# Altium project MiniPC.PrjPcb (part 14 of 17)

## Sheet 3.3V_to_1.0V.SchDoc: 3.3V to 1.0V Converter
size B; DocumentNumber: 41; SheetNumber: 41; SheetTotal: 46
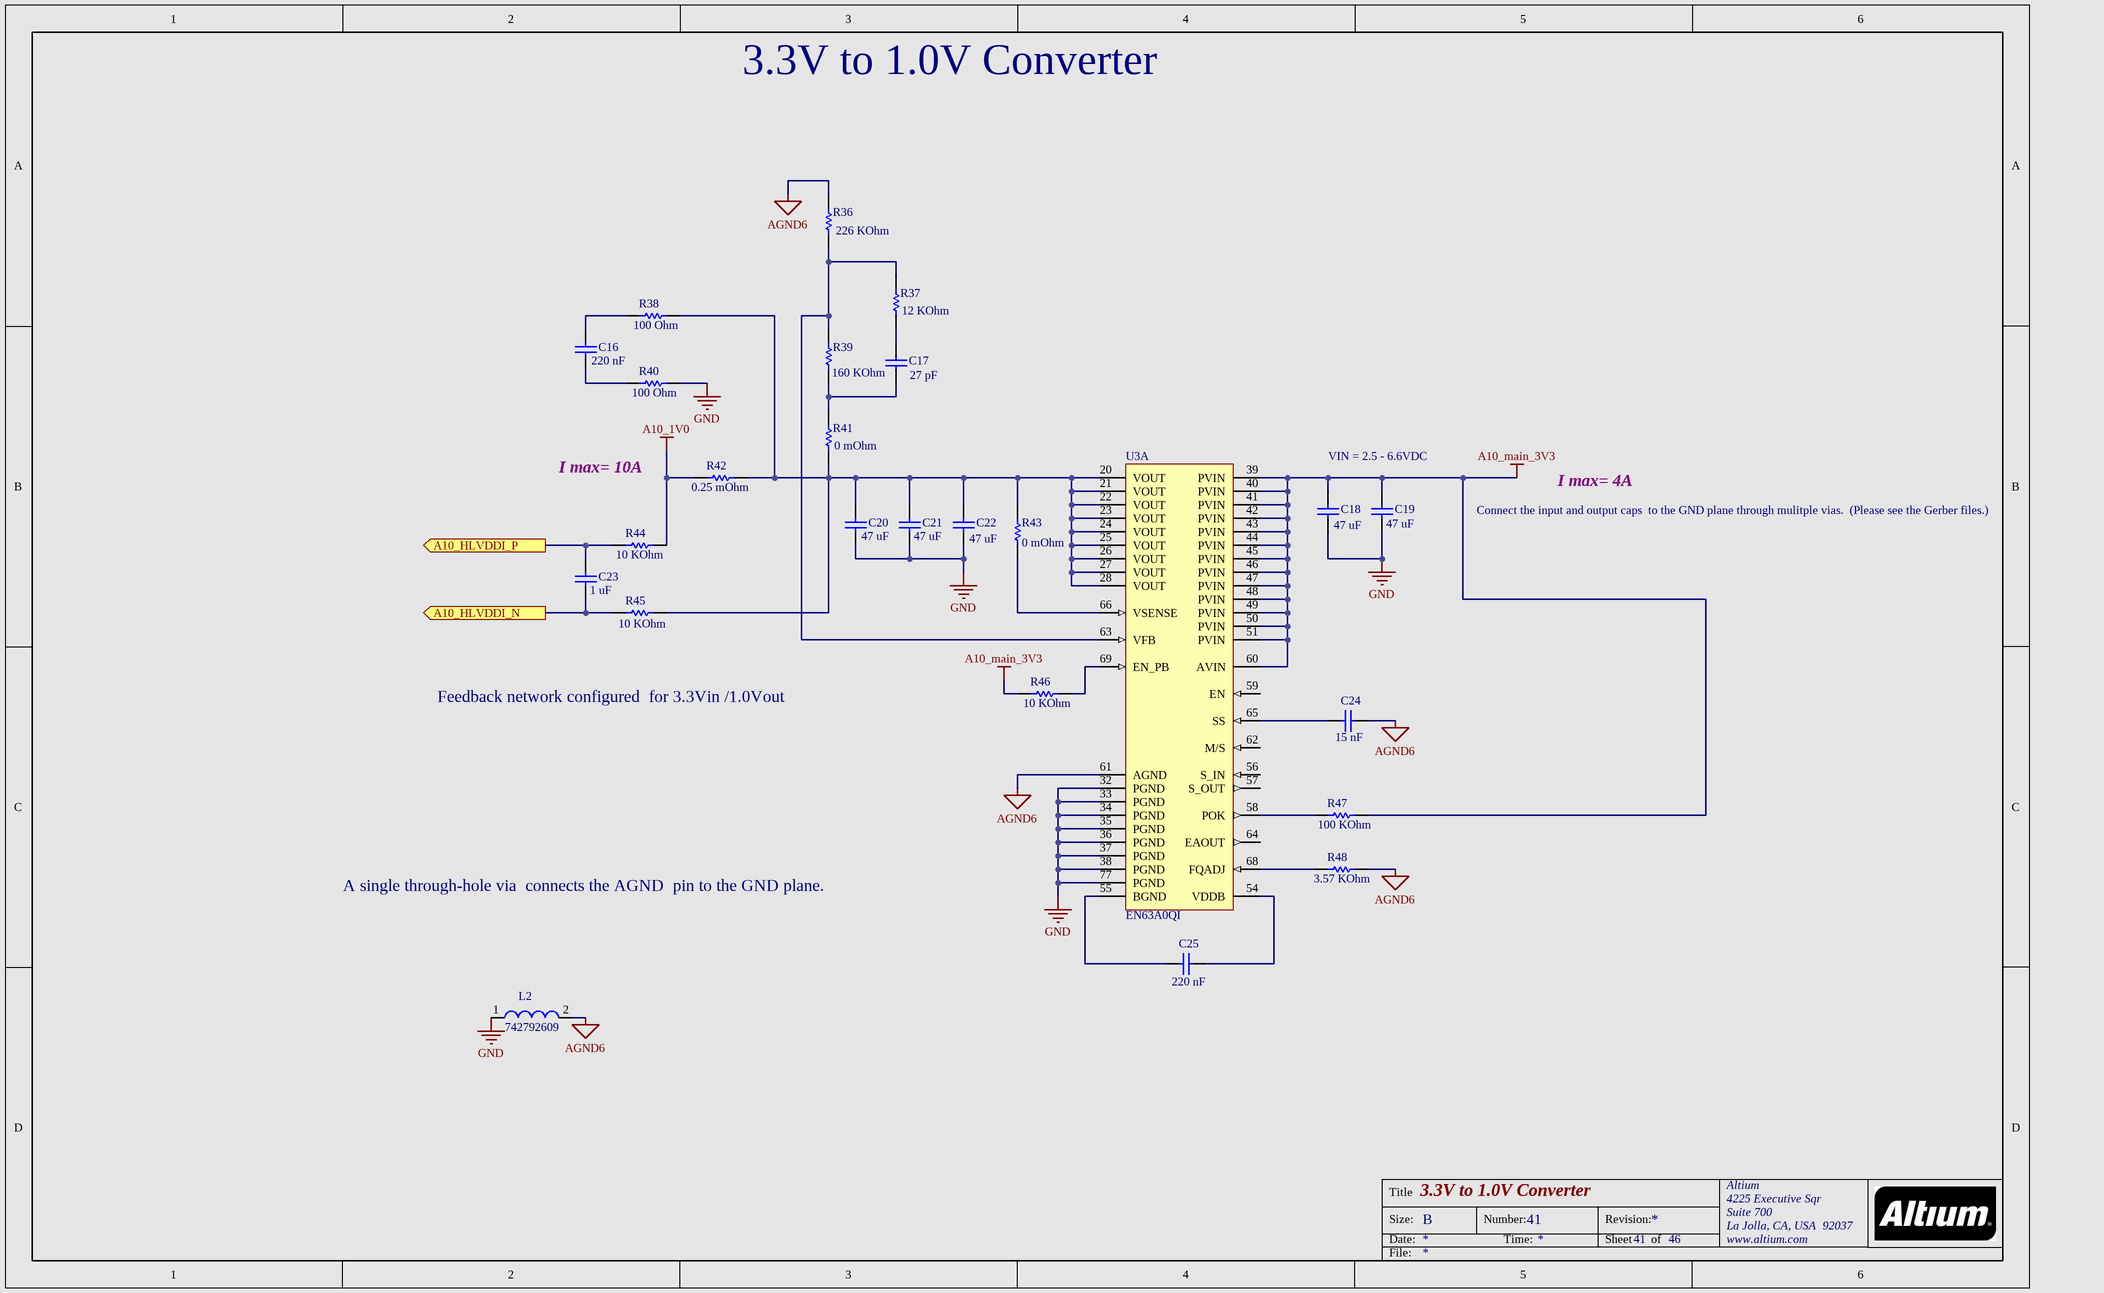
[diagram p43: 3.3V_to_1.0V.SchDoc]

### Parts
C16  Capacitance: 220 nF  [CAPC1005X55X25NL05T10]  (hidden comment: GRM155R61A224KE19D)
C17  Capacitance: 27 pF  [CAPC1005X55X20ML5T10]  (hidden comment: ECJ-0EC1H270J)
C18  Capacitance: 47 uF  [CAPC3216X180X20ML20]  (hidden comment: C3216X5R1A476M160AB)
C19  Capacitance: 47 uF  [CAPC3216X180X20ML20]  (hidden comment: C3216X5R1A476M160AB)
C20  Capacitance: 47 uF  [CAPC3216X180X20ML20]  (hidden comment: C3216X5R1A476M160AB)
C21  Capacitance: 47 uF  [CAPC3216X180X20ML20]  (hidden comment: C3216X5R1A476M160AB)
C22  Capacitance: 47 uF  [CAPC3216X180X20ML20]  (hidden comment: C3216X5R1A476M160AB)
C23  Capacitance: 1 uF  [CAPC1005X33X10LL5]  (hidden comment: CGB2A1X5R1E105K033BC)
C24  Capacitance: 15 nF  [CAPC1005X55X23ML05T8]  (hidden comment: VJ0402Y153JXQPW1BC)
C25  Capacitance: 220 nF  [CAPC1005X55X25NL05T10]  (hidden comment: GRM155R61A224KE19D)
L2  742792609  [SMD-0603]
R36  Resistance: 226 KOhm  [RESC1005X40X25NL05T05]  (hidden comment: ERJ-2RKF2263X)
R37  Resistance: 12 KOhm  [RESC1005X40X25ML05T05]  (hidden comment: ERJ-2RKF1202X)
R38  Resistance: 100 Ohm  [RESC1005X40X25LL05T05]  (hidden comment: ERJ-2RKF1000X)
R39  Resistance: 160 KOhm  [RESC1005X40X25ML05T05]  (hidden comment: CRCW0402160KFKED)
R40  Resistance: 100 Ohm  [RESC1005X40X25LL05T05]  (hidden comment: ERJ-2RKF1000X)
R41  Resistance: 0 mOhm  [RESC1005X40X25ML05T05]  (hidden comment: ERJ-2GE0R00X)
R42  Resistance: 0.25 mOhm  [STAC-CSS2725-099H_V]  (hidden comment: CSS2725FTL250)
R43  Resistance: 0 mOhm  [RESC1005X40X25ML05T05]  (hidden comment: ERJ-2GE0R00X)
R44  Resistance: 10 KOhm  [RESC1005X40X25NL05T05]  (hidden comment: ERJ-2RKF1002X)
R45  Resistance: 10 KOhm  [RESC1005X40X25NL05T05]  (hidden comment: ERJ-2RKF1002X)
R46  Resistance: 10 KOhm  [RESC1005X40X25NL05T05]  (hidden comment: ERJ-2RKF1002X)
R47  Resistance: 100 KOhm  [RESC1005X40X25LL05T05]  (hidden comment: ERJ-2RKF1003X)
R48  Resistance: 3.57 KOhm  [RESC1005X40X25NL05T05]  (hidden comment: CRCW04023K57FKED)
U3  EN63A0QI  [ALTR-QFN-76_A-305_V]  (part A of 2)

### Ports
A10_HLVDDI_N (out), A10_HLVDDI_P (out)

### Nets
A10_1V0: R42.1 R44.2
A10_main_3V3: C18.2 C19.2 R46.1 R47.2 U3.39(PVIN) U3.40(PVIN) U3.41(PVIN) U3.42(PVIN) U3.43(PVIN) U3.44(PVIN) U3.45(PVIN) U3.46(PVIN) U3.47(PVIN) U3.48(PVIN) U3.49(PVIN) U3.50(PVIN) U3.51(PVIN) U3.60(AVIN)
AGND6: C24.1 L2.2 R36.2 R48.2 U3.61(AGND)
GND: C18.1 C19.1 C20.1 C21.1 C22.1 L2.1 R40.1 U3.32(PGND) U3.33(PGND) U3.34(PGND) U3.35(PGND) U3.36(PGND) U3.37(PGND) U3.38(PGND) U3.77(PGND)
A10_HLVDDI_N: C23.1 R45.1 ; port A10_HLVDDI_N
A10_HLVDDI_P: C23.2 R44.1 ; port A10_HLVDDI_P
NetC16_1: C16.1 R38.2
NetC16_2: C16.2 R40.2
NetC17_1: C17.1 R39.1 R41.2
NetC17_2: C17.2 R37.1
NetC20_2: C20.2 C21.2 C22.2 R38.1 R41.1 R42.2 R43.2 R45.2 U3.20(VOUT) U3.21(VOUT) U3.22(VOUT) U3.23(VOUT) U3.24(VOUT) U3.25(VOUT) U3.26(VOUT) U3.27(VOUT) U3.28(VOUT)
NetC24_2: C24.2 U3.65(SS)
NetC25_1: C25.1 U3.55(BGND)
NetC25_2: C25.2 U3.54(VDDB)
NetR36_1: R36.1 R37.2 R39.2 U3.63(VFB)
NetR43_1: R43.1 U3.66(VSENSE)
NetR46_2: R46.2 U3.69(EN_PB)
NetR47_1: R47.1 U3.58(POK)
NetR48_1: R48.1 U3.68(FQADJ)

Not connected (* = marked no-connect by the designer): U3 56(S_IN) 57(S_OUT) 59(EN) 62(M/S) 64(EAOUT)

### Notes on the sheet
- I max= 10A
- VIN = 2.5 - 6.6VDC
- I max= 4A
- Connect the input and output caps  to the GND plane through mulitple vias.  (Please see the Gerber files.)
- Feedback network configured  for 3.3Vin /1.0Vout
- A single through-hole via  connects the AGND  pin to the GND plane.
- Title
- Size:
- Date:
- B
- Number:
- Time:
- Revision:
- Sheet
- of
- File:

### Library data of the parts
C16 C25 = CMP-2008-04561-4: as C115 on sheet 12V_to_5V; ComponentLink1URL: http://www.murata.com/; Package Quantity: 1; Tolerance: 10%; Mounting Technology: Surface Mount; RoHSCompliant: true; PartNumber: GRM155R61A224KE19D; Max Operating Temperature: 85 degC; Case Code (Imperial): 0402; Length: 1 mm; Packaging: Tape and Reel; Min Operating Temperature: -55 degC; PackageDescription: 2-Pin Surface Mount Device, Body 1 x 0.5 mm; Height: 0.5 mm; Case Code (Metric): 1005; REACH SVHC: No SVHC; ComponentLink1Description: Manufacturer URL; Width: 0.5 mm; ComponentLink2URL: http://search.murata.co.jp/Ceramy/image/img/A01X/G101/ENG/GRM155R61A224KE19-01.pdf; Radiation Hardening: No; Pins: 2; Voltage Rating (DC): 10 V; DatasheetVersion: 03/2016; Mount: Surface Mount; PackageReference: 0402; ComponentLink2Description: Datasheet
C17 = CMP-1665-00021-1: Chip Capacitor, 27 pF, +/- 5%, 50 V, -55 to 125 degC, 0402 (1005 Metric), RoHS, Tape and Reel; Voltage Rating: 50 V; Case\/Package: 0402; Type (Capacitors): C0G; Tolerance: 5%; Min Operating Temperature: -55 degC; Max Operating Temperature: 125 degC; DatasheetVersion: 09/2008; Width: 0.02 inch; Packaging: Tape and Reel; RoHSCompliant: true; ComponentLink2URL: http://media.digikey.com/pdf/Data%20Sheets/Panasonic%20Capacitors%20PDFs/ECJ_(General).pdf; Mount: Surface Mount; ComponentLink1URL: http://www.panasonic.com/; PackageDescription: 2-Pin Surface Mount Device, Body 1 x 0.5 mm; Length: 0.039 inch; Case Code (Metric): 1005; Package Quantity: 10000; ComponentLink2Description: Datasheet; PackageReference: 0402; Height: 0.5 mm; Case Code (Imperial): 0402; Mounting Technology: Surface Mount; ComponentLink1Description: Manufacturer URL
C18-C22 = CMP-1663-00005-1: as C112 on sheet 12V_to_5V; Tolerance: 20%; Voltage Rating: 10 V; Packaging: Tape and Reel; ComponentLink2URL: https://product.tdk.com/info/en/catalog/datasheets/mlcc_commercial_general_en.pdf; Min Operating Temperature: -55 degC; Length: 3.2 mm; Radiation Hardening: No; Mounting Technology: Surface Mount; PackageDescription: 2-Pin Surface Mount Device, Body 3.2 x 1.6 mm; Max Operating Temperature: 85 degC; Case Code (Metric): 3216; ComponentLink1URL: http://www.tdk.com/; DatasheetVersion: 03/2015; Mount: Surface Mount; Case Code (Imperial): 1206; Package Quantity: 2000; ComponentLink2Description: Datasheet; PackageReference: 3216; Height: 1.6 mm; RoHSCompliant: true; Width: 1.6 mm; ComponentLink1Description: Manufacturer URL
C23 = CMP-1663-00006-2: as C109 on sheet 12V_to_5V; Tolerance: 10%; PackageDescription: 2-Pin Surface Mount Device, Body 1 x 0.5 mm; PartNumber: CGB2A1X5R1E105K033BC; Case Code (Metric): 1005; DatasheetVersion: 04/2015; RoHSCompliant: True; Max Operating Temperature: 85 degC; ComponentLink2URL: https://product.tdk.com/info/en/catalog/datasheets/mlcc_commercial_lowprofile_en.pdf; Package Quantity: 1; Width: 0.02 inch; Case/Package: 0402; Case Code (Imperial): 0402; Packaging: Tape and Reel; Length: 0.039 inch; Min Operating Temperature: -55 degC; Mounting Technology: Surface Mount; ComponentLink2Description: Datasheet; ComponentLink1URL: http://www.tdk.com/; ComponentLink1Description: Manufacturer URL
C24 = CMP-1666-00015-3: as C14 on sheet 3.3V_to_0.9V; DatasheetVersion: 07/2016; ComponentLink1Description: Manufacturer URL; ComponentLink1URL: http://www.vishay.com/; PackageDescription: 2-Pin Surface Mount Device, Body 1 x 0.5 mm; ComponentLink2URL: http://www.vishay.com/docs/28548/vjw1bcbascomseries.pdf; ComponentLink2Description: Datasheet; Mounting Technology: Surface Mount; Length: 1 mm; PartNumber: VJ0402Y153JXQPW1BC; RoHSCompliant: true; Package Quantity: 50000; Min Operating Temperature: -55 degC; Case Code (Metric): 1005; Max Operating Temperature: 125 degC; Width: 0.5 mm; Tolerance: 5%; Packaging: Tape and Reel; Case Code (Imperial): 0402; Height: 0.5 mm; PackageReference: 0402; Mount: Surface Mount; Pins: 2; Voltage Rating: 10 V
L2 = CMP-0220-00193-1: as L10 on sheet 12V_to_5V; ComponentLink2URL: http://www.we-online.de/katalog/media/pdf/742792609.pdf; ComponentLink1URL: http://www.we-online.com; ComponentLink2Description: Datasheet; PackageDescription: Chip Inductor, 2-Leads, Body 1.6 x 0.8 mm; ComponentLink1Description: Manufacturer Link; PackageReference: SMD-0603; DatasheetVersion: Dec-2005; PackageVersion: 2009
R36 = CMP-2002-00784-3: Chip Resistor, 226 KOhm, +/- 1%, 100 mW, -55 to 155 degC, 0402 (1005 Metric), RoHS, Tape and Reel; Manufacturer: Basic Passives; Voltage Rating: 50 V; Power Rating: 100 mW; Case\/Package: 0402; PackageDescription: 2-Pin Surface Mount Device, Body 1 x 0.5 mm; Case Code (Metric): 1005; Tolerance: 1%; Max Operating Temperature: 155 degC; Package Quantity: 10000; Min Operating Temperature: -55 degC; Length: 1 mm; ComponentLink1Description: Manufacturer URL; Packaging: Tape and Reel; Mounting Technology: Surface Mount; PartNumber: ERJ-2RKF2263X; REACH SVHC: Unknown; RoHSCompliant: true; Mount: Surface Mount; ComponentLink1URL: http://www.panasonic.com/; Case Code (Imperial): 0402; Height: 0.35 mm; Width: 0.5 mm; ComponentLink2URL: http://industrial.panasonic.com/cdbs/www-data/pdf/RDA0000/AOA0000C86.pdf; ComponentLink2Description: Datasheet; PackageReference: 0402; Radiation Hardening: No; DatasheetVersion: 04/2015; Pins: 2; Weight: 2.8E-05oz
R37 = CMP-1665-00028-3: Chip Resistor, 12 KOhm, +/- 1%, 0.1 W, -55 to 155 degC, 0402 (1005 Metric), RoHS, Tape and Reel; Voltage Rating: 50 V; Case\/Package: 0402; Power Rating: 100 mW; Max Operating Temperature: 155 degC; Case Code (Imperial): 0402; Case Code (Metric): 1005; PartNumber: ERJ-2RKF1202X; Package Quantity: 10000; REACH SVHC: Yes; Width: 0.5 mm; Mounting Technology: Surface Mount; Packaging: Tape and Reel; Tolerance: 1%; ComponentLink1Description: Manufacturer URL; ComponentLink1URL: http://www.panasonic.com/; Height: 0.35 mm; Length: 1 mm; PackageDescription: 2-Pin Surface Mount Device, Body 1 x 0.5 mm; Min Operating Temperature: -55 degC; RoHSCompliant: true; ComponentLink2URL: http://industrial.panasonic.com/cdbs/www-data/pdf/RDA0000/AOA0000C86.pdf; DatasheetVersion: 04/2015; ComponentLink2Description: Datasheet; PackageReference: 0402; Pins: 2; Mount: Surface Mount
R38 R40 = CMP-2002-00605-3: as R28 on sheet 3.3V_to_0.9V; ComponentLink1URL: http://www.panasonic.com/; Package Quantity: 10000; Packaging: Tape and Reel; PackageDescription: 2-Pin Surface Mount Device, Body 1 x 0.5 mm; Tolerance: 1%; ComponentLink1Description: Manufacturer URL; REACH SVHC: Yes; Case Code (Imperial): 0402; Mounting Technology: Surface Mount; Min Operating Temperature: -55 degC; RoHSCompliant: true; Length: 1 mm; Width: 0.5 mm; Height: 0.35 mm; Max Operating Temperature: 155 degC; PartNumber: ERJ-2RKF1000X; Mount: Surface Mount; Case Code (Metric): 1005; Pins: 2; ComponentLink2Description: Datasheet; PackageReference: 0402; DatasheetVersion: 04/2015; Radiation Hardening: No; ComponentLink2URL: http://industrial.panasonic.com/cdbs/www-data/pdf/RDA0000/AOA0000C86.pdf
R39 = CMP-2002-08227-3: as R24 on sheet 3.3V_to_0.9V; Tolerance: 1%; Min Operating Temperature: -55 degC; Length: 1 mm; Height: 0.35 mm; Package Quantity: 10; Mounting Technology: Surface Mount; Mount: Surface Mount; Max Operating Temperature: 155 degC; PartNumber: CRCW0402160KFKED; Case Code (Imperial): 0402; Packaging: Tape and Reel; ComponentLink1Description: Manufacturer URL; Case Code (Metric): 1005; ComponentLink1URL: http://www.vishay.com/; RoHSCompliant: true; REACH SVHC: Unknown; PackageDescription: 2-Pin Surface Mount Device, Body 1 x 0.5 mm; Width: 0.5 mm; ComponentLink2Description: Datasheet; Pins: 2; PackageReference: 0402; Weight: 2.3E-05oz; ComponentLink2URL: http://www.vishay.com/docs/20035/dcrcwe3.pdf; Radiation Hardening: No; DatasheetVersion: 06/2012
R41 R43 = CMP-2002-00429-3: as R173 on sheet 12V_to_5V; Max Operating Temperature: 155 degC; Tolerance: 5%; PartNumber: ERJ-2GE0R00X; Case Code (Imperial): 0402; Package Quantity: 10000; Length: 1 mm; Mounting Technology: Surface Mount; ComponentLink1URL: http://www.panasonic.com/; Height: 0.35 mm; Width: 0.5 mm; Min Operating Temperature: -55 degC; Case Code (Metric): 1005; RoHSCompliant: true; REACH SVHC: Unknown; ComponentLink1Description: Manufacturer URL; Packaging: Tape and Reel; Mount: Surface Mount; PackageDescription: 2-Pin Surface Mount Device, Body 1 x 0.5 mm; PackageReference: 0402; ComponentLink2URL: http://industrial.panasonic.com/cdbs/www-data/pdf/RDA0000/AOA0000C84.pdf; DatasheetVersion: 03/2015; Radiation Hardening: No; Pins: 2; ComponentLink2Description: Datasheet
R42 = CMP-1719-00001-2: Chip Resistor, 0.25 mOhm, +/- 1%, 4 W, -55 to 225 degC, 2725 (6865 Metric), RoHS, Tape and Reel; RoHSCompliant: True; ComponentLink2URL: https://www.seielect.com/catalog/SEI-CSS_CSSH.PDF; DatasheetVersion: 06/2016; Radiation Hardening: No; Packaging: Tape and Reel; Package Quantity: 1000; Max Operating Temperature: 225 degC; PackageDescription: 2-Pin Surface Mount Device, Body 6.81 x 6.45 mm; PartNumber: CSS2725FTL250; Length: 0.268 inch; Height: 0.049 inch; ComponentLink1Description: Manufacturer URL; Mounting Technology: Surface Mount; Width: 0.254 inch; ComponentLink2Description: Datasheet; ComponentLink1URL: https://www.seielect.com/; Min Operating Temperature: -55 degC; Tolerance: 1%
R44-R46 = CMP-2002-00607-3: as R175 on sheet 12V_to_5V; Case Code (Imperial): 0402; Min Operating Temperature: -55 degC; PartNumber: ERJ-2RKF1002X; Mounting Technology: Surface Mount; Length: 1 mm; Packaging: Tape and Reel; ComponentLink1Description: Manufacturer URL; Mount: Surface Mount; Package Quantity: 10000; Max Operating Temperature: 155 degC; Case Code (Metric): 1005; Height: 0.35 mm; ComponentLink1URL: http://www.panasonic.com/; Tolerance: 1%; REACH SVHC: Yes; RoHSCompliant: true; Width: 0.5 mm; PackageDescription: 2-Pin Surface Mount Device, Body 1 x 0.5 mm; Radiation Hardening: No; PackageReference: 0402; ComponentLink2Description: Datasheet; DatasheetVersion: 04/2015; ComponentLink2URL: http://industrial.panasonic.com/cdbs/www-data/pdf/RDA0000/AOA0000C86.pdf; Pins: 2
R47 = CMP-2002-00608-3: as R176 on sheet 12V_to_5V; Height: 0.35 mm; ComponentLink1Description: Manufacturer URL; Packaging: Tape and Reel; Min Operating Temperature: -55 degC; RoHSCompliant: true; PackageDescription: 2-Pin Surface Mount Device, Body 1 x 0.5 mm; Mount: Surface Mount; Package Quantity: 10000; Max Operating Temperature: 155 degC; ComponentLink1URL: http://www.panasonic.com/; Tolerance: 1%; Mounting Technology: Surface Mount; PartNumber: ERJ-2RKF1003X; Case Code (Metric): 1005; Case Code (Imperial): 0402; REACH SVHC: Yes; Length: 1 mm; Width: 0.5 mm; DatasheetVersion: 04/2015; Pins: 2; ComponentLink2Description: Datasheet; ComponentLink2URL: http://industrial.panasonic.com/cdbs/www-data/pdf/RDA0000/AOA0000C86.pdf; PackageReference: 0402; Radiation Hardening: No
R48 = CMP-2002-08586-2: as R35 on sheet 3.3V_to_0.9V; Package Quantity: 10; Mounting Technology: Surface Mount; Width: 0.5 mm; Tolerance: 1%; Height: 0.35 mm; PartNumber: CRCW04023K57FKED; RoHSCompliant: True; PackageDescription: 2-Pin Surface Mount Device, Body 1 x 0.5 mm; REACH SVHC: Unknown; Mount: Surface Mount; Packaging: Cut Tape; ComponentLink1URL: http://www.vishay.com/docs/20035/dcrcwe3.pdf; Length: 1 mm; Case Code (Metric): 1005; Case Code (Imperial): 0402; Min Operating Temperature: -55 degC; Case/Package: 0402; Max Operating Temperature: 155 degC; ComponentLink1Description: Datasheet
U3 = CMP-1689-00005-3: PowerSoC Highly Integrated Synchronous Buck with Integrated Inductor, 2.5 to 6.6 V Input, -40 to 85 degC, 76-Pin QFN, RoHS, Tape and Reel; Output Current: 12 A; PartNumber: EN63A0QI; PackageVersion: Rev. A, 10/2014; ComponentLink3Description: Package Specification; ComponentLink3URL: http://wl.altera.com/literature/ds/EN63A0QA_10398.pdf; PackageDescription: 76-Pin Quad-Flat No-Leads Package, Body 11 x 10 mm, Pitch 0.5 mm, Thermal Pad 2.6x8.1mm; ComponentLink1URL: https://www.altera.com/; DatasheetVersion: Rev. H; Mounting Technology: Surface Mount; ComponentLink2Description: Datasheet; ComponentLink1Description: Manufacturer URL; ComponentLink2URL: https://www.altera.com/content/dam/altera-www/global/en_US/pdfs/literature/ds/en63a0qi_07077.pdf; Pins: 76; Min Operating Temperature: -40 degC; Length: 0.43 inch; Radiation Hardening: No; Max Operating Temperature: 85 degC; Package Quantity: 250; Width: 0.39 inch; Mount: Surface Mount; Packaging: Tape and Reel; Height: 0.12 inch; RoHSCompliant: True

## Sheet 3.3V_to_DDR4_VDD.SchDoc: 3.3V to VDD converter
size B; DocumentNumber: 42; SheetNumber: 42; SheetTotal: 46
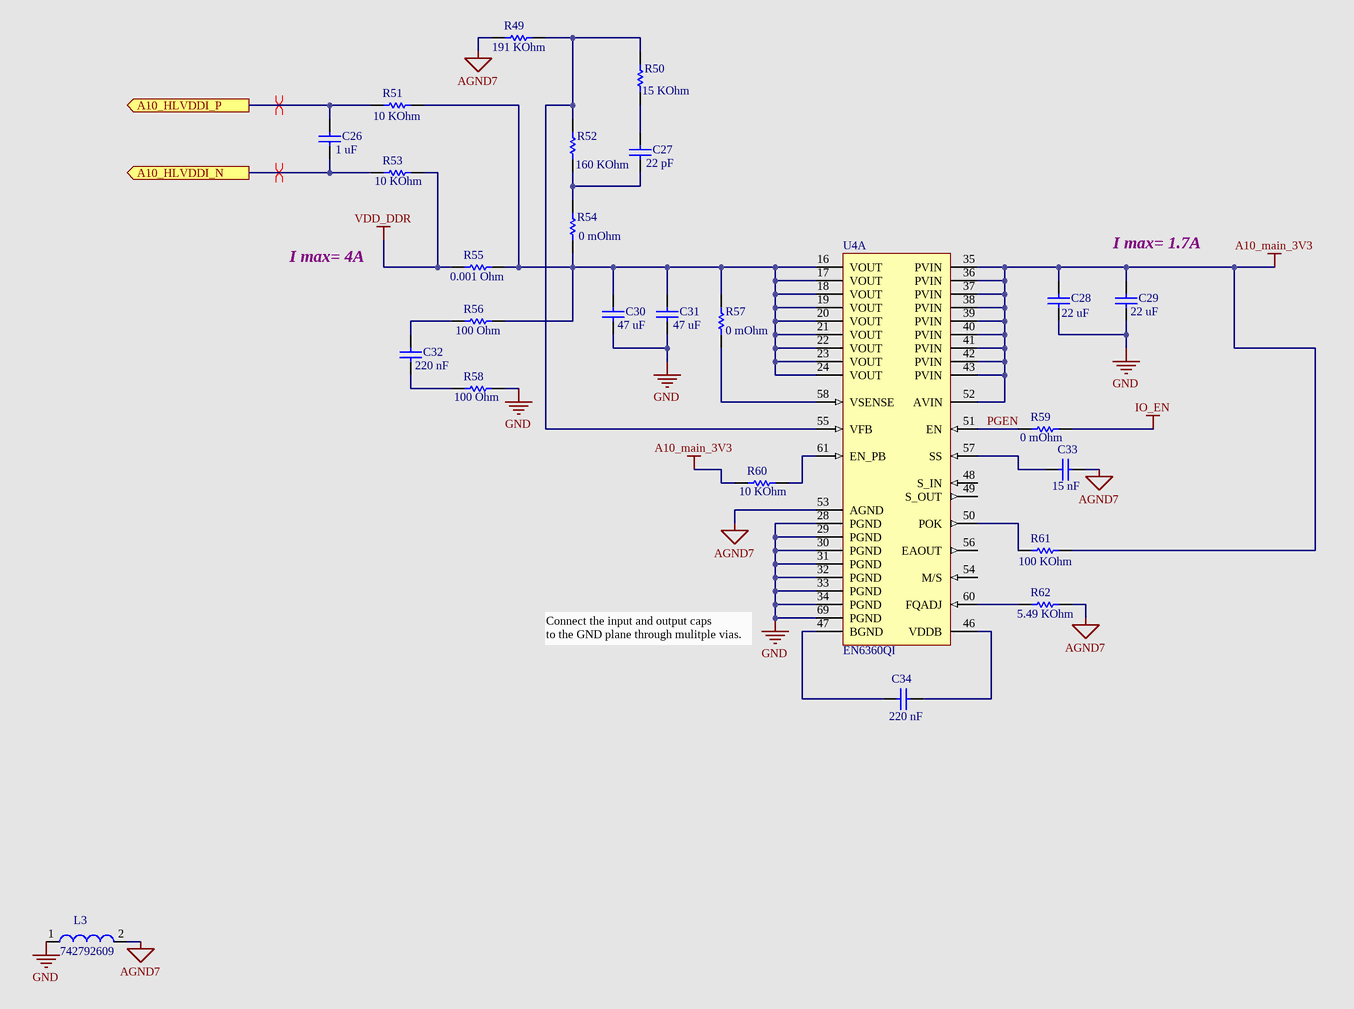
[diagram p44: 3.3V_to_DDR4_VDD.SchDoc]

### Parts
C26  Capacitance: 1 uF  [CAPC1005X33X10LL5]  (hidden comment: CGB2A1X5R1E105K033BC)
C27  Capacitance: 22 pF  [CAPC1005X55X10LL05]  (hidden comment: C1005C0G1H220J050BA)
C28  Capacitance: 22 uF  [CAPC3216X180X55ML20T25]  (hidden comment: GRM31CR61E226KE15L)
C29  Capacitance: 22 uF  [CAPC3216X180X55ML20T25]  (hidden comment: GRM31CR61E226KE15L)
C30  Capacitance: 47 uF  [CAPC3216X180X20ML20]  (hidden comment: C3216X5R1A476M160AB)
C31  Capacitance: 47 uF  [CAPC3216X180X20ML20]  (hidden comment: C3216X5R1A476M160AB)
C32  Capacitance: 220 nF  [CAPC1005X55X25NL05T10]  (hidden comment: GRM155R61A224KE19D)
C33  Capacitance: 15 nF  [CAPC1005X55X23ML05T8]  (hidden comment: VJ0402Y153JXQPW1BC)
C34  Capacitance: 220 nF  [CAPC1005X55X25NL05T10]  (hidden comment: GRM155R61A224KE19D)
L3  742792609  [SMD-0603]
R49  Resistance: 191 KOhm  [RESC1005X40X25LL05T05]  (hidden comment: CRCW0402191KFKED)
R50  Resistance: 15 KOhm  [RESC1005X40X25ML05T05]  (hidden comment: ERJ-2RKF1502X)
R51  Resistance: 10 KOhm  [RESC1005X40X25NL05T05]  (hidden comment: ERJ-2RKF1002X)
R52  Resistance: 160 KOhm  [RESC1005X40X25ML05T05]  (hidden comment: CRCW0402160KFKED)
R53  Resistance: 10 KOhm  [RESC1005X40X25NL05T05]  (hidden comment: ERJ-2RKF1002X)
R54  Resistance: 0 mOhm  [RESC1005X40X25ML05T05]  (hidden comment: ERJ-2GE0R00X)
R55  Resistance: 0.001 Ohm  [RESC3216X89X104LL25T25]  (hidden comment: WSLP12061L000FEA)
R56  Resistance: 100 Ohm  [RESC1005X40X25LL05T05]  (hidden comment: ERJ-2RKF1000X)
R57  Resistance: 0 mOhm  [RESC1005X40X25ML05T05]  (hidden comment: ERJ-2GE0R00X)
R58  Resistance: 100 Ohm  [RESC1005X40X25LL05T05]  (hidden comment: ERJ-2RKF1000X)
R59  Resistance: 0 mOhm  [RESC1005X40X25ML05T05]  (hidden comment: ERJ-2GE0R00X)
R60  Resistance: 10 KOhm  [RESC1005X40X25NL05T05]  (hidden comment: ERJ-2RKF1002X)
R61  Resistance: 100 KOhm  [RESC1005X40X25LL05T05]  (hidden comment: ERJ-2RKF1003X)
R62  Resistance: 5.49 KOhm  [RESC1005X40X25NL05T05]  (hidden comment: ERJ-2RKF5491X)
U4  EN6360QI  [ALTR-QFN-68_A-305_V]  (part A of 2)

### Ports
A10_HLVDDI_N (out), A10_HLVDDI_P (out)

### Nets
A10_main_3V3: C28.2 C29.2 R60.1 R61.2 U4.35(PVIN) U4.36(PVIN) U4.37(PVIN) U4.38(PVIN) U4.39(PVIN) U4.40(PVIN) U4.41(PVIN) U4.42(PVIN) U4.43(PVIN) U4.52(AVIN)
AGND7: C33.1 L3.2 R49.1 R62.2 U4.53(AGND)
GND: C28.1 C29.1 C30.1 C31.1 L3.1 R58.1 U4.28(PGND) U4.29(PGND) U4.30(PGND) U4.31(PGND) U4.32(PGND) U4.33(PGND) U4.34(PGND) U4.69(PGND)
IO_EN: R59.2
VDD_DDR: R53.2 R55.1
A10_HLVDDI_N: C26.1 R53.1 ; port A10_HLVDDI_N
A10_HLVDDI_P: C26.2 R51.1 ; port A10_HLVDDI_P
PGEN: R59.1 U4.51(EN)
NetC27_1: C27.1 R52.1 R54.2
NetC27_2: C27.2 R50.1
NetC30_2: C30.2 C31.2 R51.2 R54.1 R55.2 R56.1 R57.2 U4.16(VOUT) U4.17(VOUT) U4.18(VOUT) U4.19(VOUT) U4.20(VOUT) U4.21(VOUT) U4.22(VOUT) U4.23(VOUT) U4.24(VOUT)
NetC32_1: C32.1 R56.2
NetC32_2: C32.2 R58.2
NetC33_2: C33.2 U4.57(SS)
NetC34_1: C34.1 U4.47(BGND)
NetC34_2: C34.2 U4.46(VDDB)
NetR49_2: R49.2 R50.2 R52.2 U4.55(VFB)
NetR57_1: R57.1 U4.58(VSENSE)
NetR60_2: R60.2 U4.61(EN_PB)
NetR61_1: R61.1 U4.50(POK)
NetR62_1: R62.1 U4.60(FQADJ)

Not connected (* = marked no-connect by the designer): U4 48(S_IN) 49(S_OUT) 54(M/S) 56(EAOUT)

### Layout directives
differential pair: A10_HLVDDI_N, A10_HLVDDI_P

### Notes on the sheet
- I max= 4A
- (near C29) I max= 1.7A
- Connect the input and output caps
  to the GND plane through mulitple vias.
- Title
- Size:
- Date:
- B
- Number:
- Time:
- Revision:
- Sheet
- of
- File:

### Library data of the parts
C26 = CMP-1663-00006-2: as C109 on sheet 12V_to_5V; Tolerance: 10%; PackageDescription: 2-Pin Surface Mount Device, Body 1 x 0.5 mm; PartNumber: CGB2A1X5R1E105K033BC; Case Code (Metric): 1005; DatasheetVersion: 04/2015; RoHSCompliant: True; Max Operating Temperature: 85 degC; ComponentLink2URL: https://product.tdk.com/info/en/catalog/datasheets/mlcc_commercial_lowprofile_en.pdf; Package Quantity: 1; Width: 0.02 inch; Case/Package: 0402; Case Code (Imperial): 0402; Packaging: Tape and Reel; Length: 0.039 inch; Min Operating Temperature: -55 degC; Mounting Technology: Surface Mount; ComponentLink2Description: Datasheet; ComponentLink1URL: http://www.tdk.com/; ComponentLink1Description: Manufacturer URL
C27 = CMP-1663-00008-2: as C8 on sheet 3.3V_to_0.9V; Tolerance: 5%; ComponentLink2URL: https://product.tdk.com/info/en/catalog/datasheets/mlcc_commercial_general_en.pdf; RoHSCompliant: true; Mounting Technology: Surface Mount; Case Code (Metric): 1005; PackageDescription: 2-Pin Surface Mount Device, Body 1 x 0.5 mm; ComponentLink1URL: http://www.tdk.com/; Packaging: Tape and Reel; ComponentLink1Description: Manufacturer URL; PackageReference: 0402; Package Quantity: 10000; DatasheetVersion: 08/2016; Width: 0.5 mm; Max Operating Temperature: 125 degC; Mount: Surface Mount; Height: 0.5 mm; REACH SVHC: No SVHC; Length: 1 mm; Min Operating Temperature: -55 degC; Pins: 2; Case Code (Imperial): 0402; Radiation Hardening: No; ComponentLink2Description: Datasheet; Voltage Rating (DC): 50 V; PartNumber: C1005C0G1H220J050BA
C28 C29 = CMP-1662-00010-2: as C116 on sheet 12V_to_5V; Tolerance: 10%; Max Operating Temperature: 85 degC; Package Quantity: 2000; Voltage Rating: 25 V; Case Code (Metric): 3216; Length: 3.2 mm; PackageDescription: 2-Pin Surface Mount Device, Body 3.2 x 1.6 mm; ComponentLink1Description: Manufacturer URL; Case Code (Imperial): 1206; ComponentLink1URL: http://www.murata.com/; Radiation Hardening: No; Height: 1.6 mm; Width: 1.6 mm; DatasheetVersion: 03/2016; Min Operating Temperature: -55 degC; Mount: Surface Mount; REACH SVHC: No SVHC; PackageReference: 1206; ComponentLink2URL: http://search.murata.co.jp/Ceramy/image/img/A01X/G101/ENG/GRM31CR61E226KE15-01.pdf; Packaging: Tape and Reel; RoHSCompliant: true; ComponentLink2Description: Datasheet; Mounting Technology: Surface Mount; PartNumber: GRM31CR61E226KE15L; Pins: 2
C30 C31 = CMP-1663-00005-1: as C112 on sheet 12V_to_5V; Tolerance: 20%; Voltage Rating: 10 V; Packaging: Tape and Reel; ComponentLink2URL: https://product.tdk.com/info/en/catalog/datasheets/mlcc_commercial_general_en.pdf; Min Operating Temperature: -55 degC; Length: 3.2 mm; Radiation Hardening: No; Mounting Technology: Surface Mount; PackageDescription: 2-Pin Surface Mount Device, Body 3.2 x 1.6 mm; Max Operating Temperature: 85 degC; Case Code (Metric): 3216; ComponentLink1URL: http://www.tdk.com/; DatasheetVersion: 03/2015; Mount: Surface Mount; Case Code (Imperial): 1206; Package Quantity: 2000; ComponentLink2Description: Datasheet; PackageReference: 3216; Height: 1.6 mm; RoHSCompliant: true; Width: 1.6 mm; ComponentLink1Description: Manufacturer URL
C32 C34 = CMP-2008-04561-4: as C115 on sheet 12V_to_5V; ComponentLink1URL: http://www.murata.com/; Package Quantity: 1; Tolerance: 10%; Mounting Technology: Surface Mount; RoHSCompliant: true; PartNumber: GRM155R61A224KE19D; Max Operating Temperature: 85 degC; Case Code (Imperial): 0402; Length: 1 mm; Packaging: Tape and Reel; Min Operating Temperature: -55 degC; PackageDescription: 2-Pin Surface Mount Device, Body 1 x 0.5 mm; Height: 0.5 mm; Case Code (Metric): 1005; REACH SVHC: No SVHC; ComponentLink1Description: Manufacturer URL; Width: 0.5 mm; ComponentLink2URL: http://search.murata.co.jp/Ceramy/image/img/A01X/G101/ENG/GRM155R61A224KE19-01.pdf; Radiation Hardening: No; Pins: 2; Voltage Rating (DC): 10 V; DatasheetVersion: 03/2016; Mount: Surface Mount; PackageReference: 0402; ComponentLink2Description: Datasheet
C33 = CMP-1666-00015-3: as C14 on sheet 3.3V_to_0.9V; DatasheetVersion: 07/2016; ComponentLink1Description: Manufacturer URL; ComponentLink1URL: http://www.vishay.com/; PackageDescription: 2-Pin Surface Mount Device, Body 1 x 0.5 mm; ComponentLink2URL: http://www.vishay.com/docs/28548/vjw1bcbascomseries.pdf; ComponentLink2Description: Datasheet; Mounting Technology: Surface Mount; Length: 1 mm; PartNumber: VJ0402Y153JXQPW1BC; RoHSCompliant: true; Package Quantity: 50000; Min Operating Temperature: -55 degC; Case Code (Metric): 1005; Max Operating Temperature: 125 degC; Width: 0.5 mm; Tolerance: 5%; Packaging: Tape and Reel; Case Code (Imperial): 0402; Height: 0.5 mm; PackageReference: 0402; Mount: Surface Mount; Pins: 2; Voltage Rating: 10 V
L3 = CMP-0220-00193-1: as L10 on sheet 12V_to_5V; ComponentLink2URL: http://www.we-online.de/katalog/media/pdf/742792609.pdf; ComponentLink1URL: http://www.we-online.com; ComponentLink2Description: Datasheet; PackageDescription: Chip Inductor, 2-Leads, Body 1.6 x 0.8 mm; ComponentLink1Description: Manufacturer Link; PackageReference: SMD-0603; DatasheetVersion: Dec-2005; PackageVersion: 2009
R49 = CMP-2002-08268-3: Chip Resistor, 191 KOhm, +/- 1%, 63 mW, -55 to 155 degC, 0402 (1005 Metric), RoHS, Tape and Reel; Manufacturer: Basic Passives; Voltage Rating: 50 V; Power Rating: 63 mW; Case\/Package: 0402; Case Code (Imperial): 0402; Height: 0.35 mm; PackageDescription: 2-Pin Surface Mount Device, Body 1 x 0.5 mm; REACH SVHC: Unknown; ComponentLink1URL: http://www.vishay.com/; Tolerance: 1%; Width: 0.5 mm; Package Quantity: 10000; ComponentLink1Description: Manufacturer URL; Packaging: Tape and Reel; Min Operating Temperature: -55 degC; Length: 1 mm; Case Code (Metric): 1005; Max Operating Temperature: 155 degC; Mounting Technology: Surface Mount; Mount: Surface Mount; RoHSCompliant: true; PartNumber: CRCW0402191KFKED; Weight: 2.3E-05oz; ComponentLink2URL: http://www.vishay.com/docs/20035/dcrcwe3.pdf; DatasheetVersion: 06/2012; ComponentLink2Description: Datasheet; Radiation Hardening: No; PackageReference: 0402; Pins: 2
R50 = CMP-2002-00694-3: as R22 on sheet 3.3V_to_0.9V; Max Operating Temperature: 155 degC; Case Code (Imperial): 0402; Case Code (Metric): 1005; PartNumber: ERJ-2RKF1502X; Package Quantity: 10000; REACH SVHC: Yes; Width: 0.5 mm; Mount: Surface Mount; Mounting Technology: Surface Mount; Packaging: Tape and Reel; Tolerance: 1%; ComponentLink1Description: Manufacturer URL; ComponentLink1URL: http://www.panasonic.com/; Height: 0.35 mm; Length: 1 mm; PackageDescription: 2-Pin Surface Mount Device, Body 1 x 0.5 mm; Min Operating Temperature: -55 degC; RoHSCompliant: true; Pins: 2; PackageReference: 0402; DatasheetVersion: 04/2015; ComponentLink2URL: http://industrial.panasonic.com/cdbs/www-data/pdf/RDA0000/AOA0000C86.pdf; Weight: 2.8E-05oz; Radiation Hardening: No; ComponentLink2Description: Datasheet
R51 R53 R60 = CMP-2002-00607-3: as R175 on sheet 12V_to_5V; Case Code (Imperial): 0402; Min Operating Temperature: -55 degC; PartNumber: ERJ-2RKF1002X; Mounting Technology: Surface Mount; Length: 1 mm; Packaging: Tape and Reel; ComponentLink1Description: Manufacturer URL; Mount: Surface Mount; Package Quantity: 10000; Max Operating Temperature: 155 degC; Case Code (Metric): 1005; Height: 0.35 mm; ComponentLink1URL: http://www.panasonic.com/; Tolerance: 1%; REACH SVHC: Yes; RoHSCompliant: true; Width: 0.5 mm; PackageDescription: 2-Pin Surface Mount Device, Body 1 x 0.5 mm; Radiation Hardening: No; PackageReference: 0402; ComponentLink2Description: Datasheet; DatasheetVersion: 04/2015; ComponentLink2URL: http://industrial.panasonic.com/cdbs/www-data/pdf/RDA0000/AOA0000C86.pdf; Pins: 2
R52 = CMP-2002-08227-3: as R24 on sheet 3.3V_to_0.9V; Tolerance: 1%; Min Operating Temperature: -55 degC; Length: 1 mm; Height: 0.35 mm; Package Quantity: 10; Mounting Technology: Surface Mount; Mount: Surface Mount; Max Operating Temperature: 155 degC; PartNumber: CRCW0402160KFKED; Case Code (Imperial): 0402; Packaging: Tape and Reel; ComponentLink1Description: Manufacturer URL; Case Code (Metric): 1005; ComponentLink1URL: http://www.vishay.com/; RoHSCompliant: true; REACH SVHC: Unknown; PackageDescription: 2-Pin Surface Mount Device, Body 1 x 0.5 mm; Width: 0.5 mm; ComponentLink2Description: Datasheet; Pins: 2; PackageReference: 0402; Weight: 2.3E-05oz; ComponentLink2URL: http://www.vishay.com/docs/20035/dcrcwe3.pdf; Radiation Hardening: No; DatasheetVersion: 06/2012
R54 R57 R59 = CMP-2002-00429-3: as R173 on sheet 12V_to_5V; Max Operating Temperature: 155 degC; Tolerance: 5%; PartNumber: ERJ-2GE0R00X; Case Code (Imperial): 0402; Package Quantity: 10000; Length: 1 mm; Mounting Technology: Surface Mount; ComponentLink1URL: http://www.panasonic.com/; Height: 0.35 mm; Width: 0.5 mm; Min Operating Temperature: -55 degC; Case Code (Metric): 1005; RoHSCompliant: true; REACH SVHC: Unknown; ComponentLink1Description: Manufacturer URL; Packaging: Tape and Reel; Mount: Surface Mount; PackageDescription: 2-Pin Surface Mount Device, Body 1 x 0.5 mm; PackageReference: 0402; ComponentLink2URL: http://industrial.panasonic.com/cdbs/www-data/pdf/RDA0000/AOA0000C84.pdf; DatasheetVersion: 03/2015; Radiation Hardening: No; Pins: 2; ComponentLink2Description: Datasheet
R55 = CMP-1666-00018-2: as R27 on sheet 3.3V_to_0.9V; Tolerance: 1%; RoHSCompliant: True; Mounting Technology: Surface Mount; ComponentLink1URL: http://www.vishay.com/; Min Operating Temperature: -65 degC; Height: 0.635 mm; ComponentLink2URL: http://www.farnell.com/datasheets/2049155.pdf; Length: 3.2 mm; ComponentLink2Description: Datasheet; ComponentLink1Description: Manufacturer URL; DatasheetVersion: 04/2015; Case Code (Imperial): 1206; Max Operating Temperature: 170 degC; Packaging: Tape and Reel; Case/Package: 1206; Width: 1.6 mm; PartNumber: WSLP12061L000FEA; REACH SVHC: Unknown; PackageDescription: 2-Pin Surface Mount Device, Body 3.2 x 1.6 mm; Case Code (Metric): 3216
R56 R58 = CMP-2002-00605-3: as R28 on sheet 3.3V_to_0.9V; ComponentLink1URL: http://www.panasonic.com/; Package Quantity: 10000; Packaging: Tape and Reel; PackageDescription: 2-Pin Surface Mount Device, Body 1 x 0.5 mm; Tolerance: 1%; ComponentLink1Description: Manufacturer URL; REACH SVHC: Yes; Case Code (Imperial): 0402; Mounting Technology: Surface Mount; Min Operating Temperature: -55 degC; RoHSCompliant: true; Length: 1 mm; Width: 0.5 mm; Height: 0.35 mm; Max Operating Temperature: 155 degC; PartNumber: ERJ-2RKF1000X; Mount: Surface Mount; Case Code (Metric): 1005; Pins: 2; ComponentLink2Description: Datasheet; PackageReference: 0402; DatasheetVersion: 04/2015; Radiation Hardening: No; ComponentLink2URL: http://industrial.panasonic.com/cdbs/www-data/pdf/RDA0000/AOA0000C86.pdf
R61 = CMP-2002-00608-3: as R176 on sheet 12V_to_5V; Height: 0.35 mm; ComponentLink1Description: Manufacturer URL; Packaging: Tape and Reel; Min Operating Temperature: -55 degC; RoHSCompliant: true; PackageDescription: 2-Pin Surface Mount Device, Body 1 x 0.5 mm; Mount: Surface Mount; Package Quantity: 10000; Max Operating Temperature: 155 degC; ComponentLink1URL: http://www.panasonic.com/; Tolerance: 1%; Mounting Technology: Surface Mount; PartNumber: ERJ-2RKF1003X; Case Code (Metric): 1005; Case Code (Imperial): 0402; REACH SVHC: Yes; Length: 1 mm; Width: 0.5 mm; DatasheetVersion: 04/2015; Pins: 2; ComponentLink2Description: Datasheet; ComponentLink2URL: http://industrial.panasonic.com/cdbs/www-data/pdf/RDA0000/AOA0000C86.pdf; PackageReference: 0402; Radiation Hardening: No
R62 = CMP-2002-00990-3: Chip Resistor, 5.49 KOhm, +/- 1%, 100 mW, -55 to 155 degC, 0402 (1005 Metric), RoHS, Tape and Reel; Manufacturer: Basic Passives; Voltage Rating: 50 V; Power Rating: 100 mW; Case\/Package: 0402; Tolerance: 1%; Packaging: Tape and Reel; RoHSCompliant: true; Length: 0.039 inch; PackageDescription: 2-Pin Surface Mount Device, Body 1 x 0.5 mm; Height: 0.016 inch; Case Code (Imperial): 0402; Min Operating Temperature: -55 degC; PartNumber: ERJ-2RKF5491X; Case Code (Metric): 1005; ComponentLink1Description: Manufacturer URL; Width: 0.02 inch; Package Quantity: 10000; ComponentLink1URL: http://www.panasonic.com/; Mount: Surface Mount; Mounting Technology: Surface Mount; REACH SVHC: Yes; Max Operating Temperature: 155 degC; ComponentLink2URL: http://industrial.panasonic.com/cdbs/www-data/pdf/RDA0000/AOA0000C86.pdf; Pins: 2; ComponentLink2Description: Datasheet; PackageReference: 0402; DatasheetVersion: 04/2015
U4 = CMP-1689-00004-3: as U2 on sheet 3.3V_to_0.9V; Mounting Technology: Surface Mount; ComponentLink2URL: https://www.altera.com/content/dam/altera-www/global/en_US/pdfs/literature/ds/en6360qi_06489.pdf; PackageVersion: Rev. A, 10/2014; ComponentLink3Description: Package Specification; ComponentLink3URL: http://wl.altera.com/literature/ds/EN6360QA_10396.pdf; ComponentLink1Description: Manufacturer URL; PartNumber: EN6360QI; ComponentLink2Description: Datasheet; PackageDescription: 68-Pin Quad-Flat No-Leads Package, Body 11 x 8 mm, Pitch 0.5 mm; ComponentLink1URL: https://www.altera.com/; Code_JEDEC: J-STD-020A; DatasheetVersion: Rev. G; Mount: Surface Mount; Max Operating Temperature: 85 degC; Pins: 68; Radiation Hardening: No; Min Operating Temperature: -40 degC; Packaging: Tape and Reel; Package Quantity: 250; RoHSCompliant: True; Width: 0.32 inch; Length: 0.43 inch; Height: 0.12 inch